# EasyEDA Pro project ProPrj_AIoT-NTU-Prototype_2026-03-28.epro, board Main Board
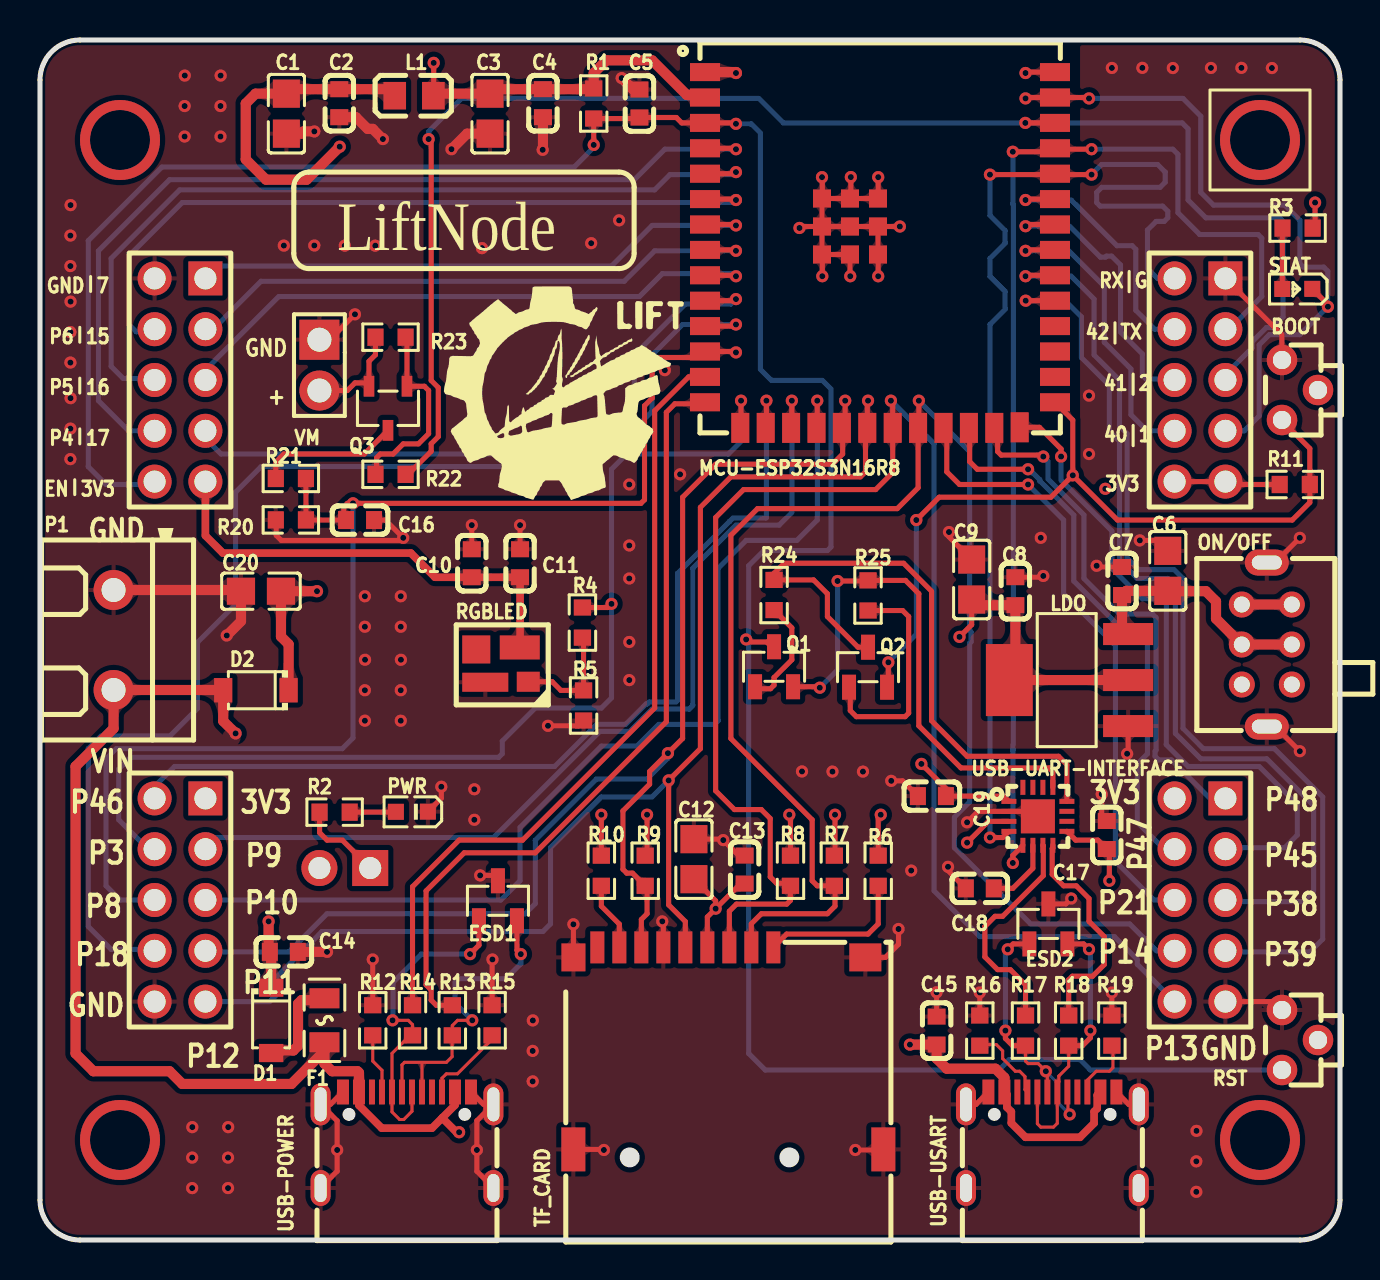
[diagram p3: board, top side]
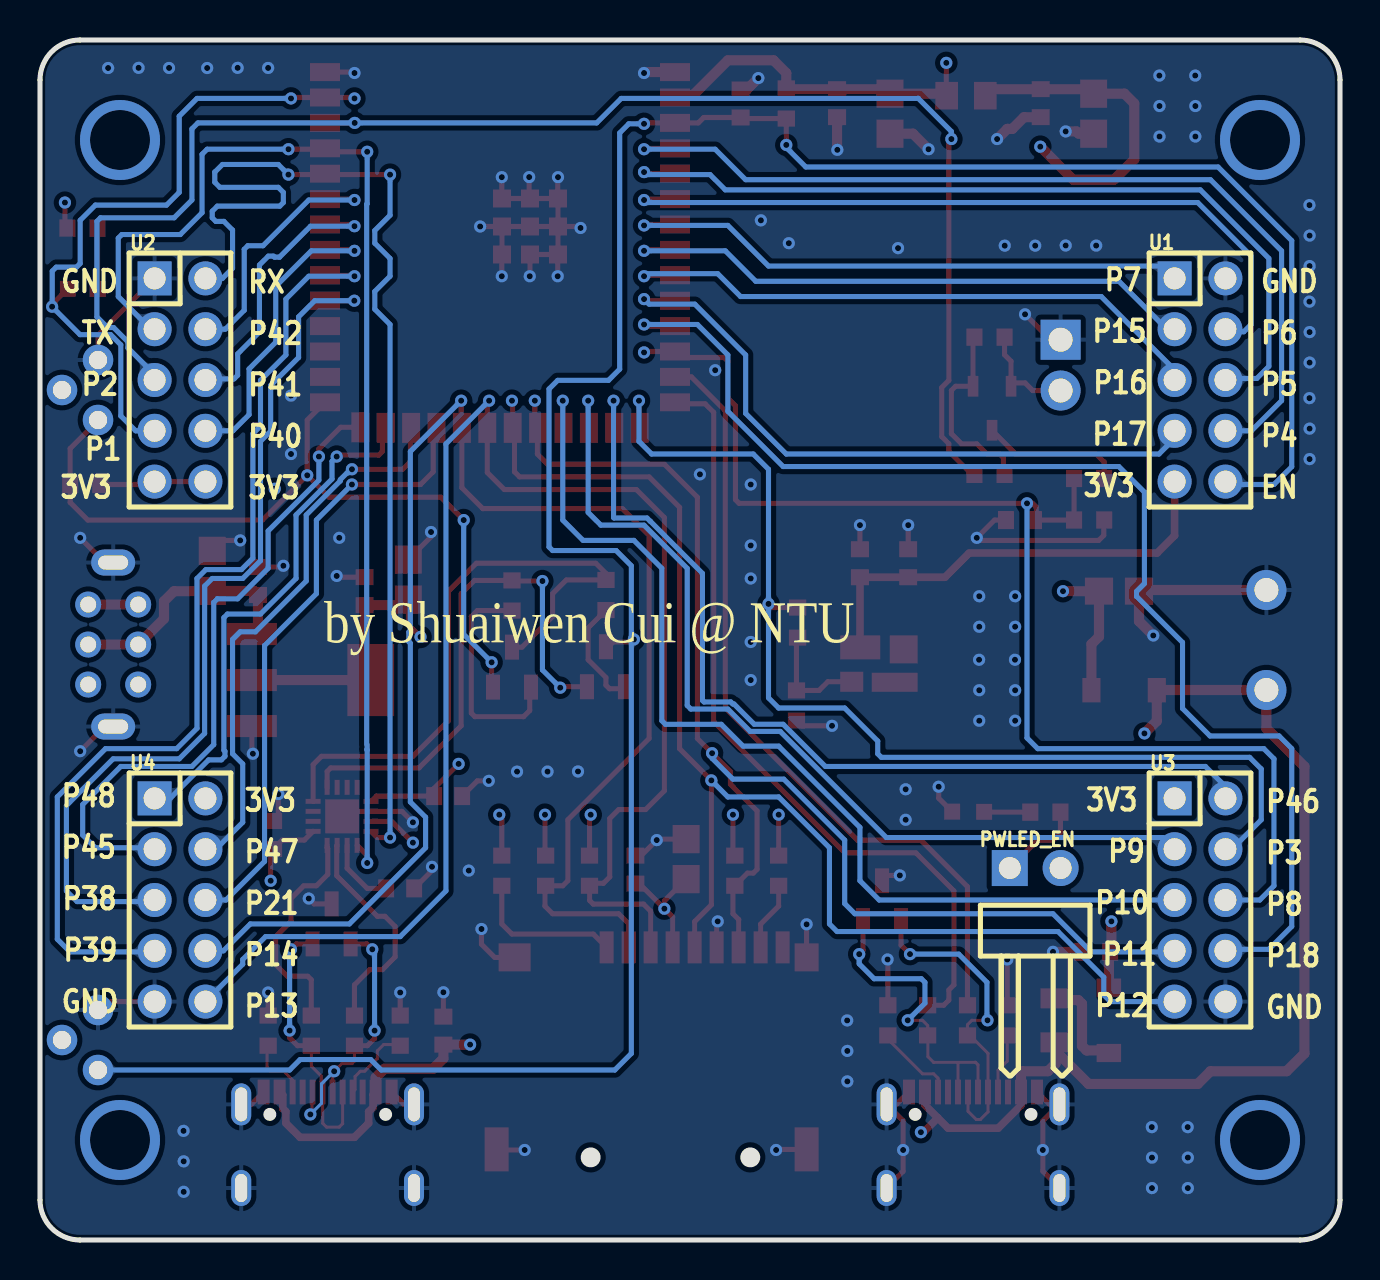
[diagram p4: board, bottom side, seen from below]

Outline 65 x 60 mm; copper layers: Top Layer, GND, PWR, Bottom Layer. Coordinates in mm from the lower left corner of the outline.
Outline path: 0,58 0,2 arc(0.59,0.59) 2,0 63,0 arc(64.41,0.59) 65,2 65,58 arc(64.41,59.41) 63,60 2,60 arc(0.59,59.41) 0,58
Stack: Top Layer 0.035mm Outer layer thickness 1oz / Dielectric1 0.2104mm 7628 RC49% 8.6mil / GND 0.0152mm Inner layer thickness / Dielectric2 1.065mm 1.1mm H/HOZ Copper / PWR 0.0152mm Inner layer thickness / Dielectric3 0.2104mm 7628 RC49% 8.6mil / Bottom Layer 0.035mm Outer layer thickness 1oz

## Design rules (mm)
net $2N532: DP1
net $2N529: DP1
net $2N923: DP3
net $2N927: DP3
net GPIO19: DP2
net GPIO20: DP2
net U0RXD: DP5
net U0TXD: DP5
net CH343P_D+: DP4
net CH343P_D-: DP4
template: JLCPCB Capability(Two Layers Board)
spacing copperThickness1oz (default): track to track 0.102, other pairs 0.152 to 0.3
spacing copperThickness2oz: track to track 0.203, other pairs 0.152 to 0.3
track width copperThickness1oz (default): min 0.127, default 0.254, max 2.54
track width copperThickness2oz: min 0.203, default 0.254, max 2.54
differential pair differentialPair (default): width min 0.127, default 0.254, max 2.54; gap min 0.152, default 0.152
via viaSize (default): diameter min 0.5, default 0.61, max 10; hole min 0.3, default 0.305, max 6.3

## Placement (name value [footprint] x y rotation side)
BOOT  TS4538B3J  [SW-TH_TS4538B3J]  63 42.5 90 top
C1  10uF/50V(10%)  [C0805]  12.32 56.32 90 top
C2  100nF/50V(10%)  [C0603]  14.96 56.84 90 top
C3  22uF/25V(20%)  [C0805]  22.5 56.32 90 top
C4  100nF/50V(10%)  [C0603]  25.15 56.84 90 top
C5  1uF/16V(10%)  [C0603]  29.97 56.83 90 top
C6  10uF/50V(10%)  [C0805]  56.39 33.46 270 top
C7  100nF/50V(10%)  [C0603]  54.1 32.95 270 top
C8  100nF/50V(10%)  [C0603]  48.77 32.44 270 top
C9  10uF/50V(10%)  [C0805]  46.58 33.02 270 top
C10  1uF/16V(10%)  [C0603]  21.59 33.84 90 top
C11  100nF/50V(10%)  [C0603]  24 33.84 270 top
C12  10uF/50V(10%)  [C0805]  32.7 19.04 270 top
C13  100nF/50V(10%)  [C0603]  35.23 18.52 270 top
C14  100nF/50V(10%)  [C0603]  12.19 14.41 180 top
C15  100nF/50V(10%)  [C0603]  44.83 10.47 270 top
C16  100nF/50V(10%)  [C0603]  16 36 0 top
C17  1uF/16V(10%)  [C0603]  53.34 20.25 90 top
C18  100nF/50V(10%)  [C0603]  46.99 17.58 0 top
C19  100nF/50V(10%)  [C0603]  44.59 22.19 180 top
C20  10uF/50V(10%)  [C0805]  11.05 32.44 180 top
D1  1N5819HW-7-F  [SOD-123_L2.7-W1.6-LS3.7-RD]  11.56 10.98 270 top
D2  1N5819HW-7-F  [SOD-123_L2.7-W1.6-LS3.7-RD]  10.79 27.49 180 top
ESD1  PESD5V0U2BT  [SOT-23-3_L2.9-W1.3-P1.90-LS2.4-BR]  22.9 16.96 270 top
ESD2  PESD5V0U2BT  [SOT-23-3_L2.9-W1.3-P1.90-LS2.4-BR]  50.42 15.8 270 top
F1  SMD0805-050-6  [F0805]  14.22 10.98 90 top
L1  BEAD  [L0805]  18.7 57.21 0 top
LDO  SGM2212-3.3XKC3G/TR  [SOT-223-3_L6.5-W3.4-P2.30-LS7.0-BR]  51.44 28 0 top
MCU-ESP32S3N16R8  ESP32-S3-WROOM-1U-N16R8  [WIRELM-SMD_ESP32-S3-WROOM-1U]  42 49.5 0 top
ON/OFF  KH-SK22D07-G5  [SW-TH_KH-SK22D07-G5]  61.34 29.77 90 top
P1  KF301-2P接线端子  [CONN-TH_XY301V-A-5.0-2P]  3.68 30 90 top
PWLED_EN  PZ254R-11-02P  [HDR-TH_2P-P2.54-H-M-W10.4]  15.24 18.6 180 bottom
PWR  XL-1608UGC-04  [LED0603-RD_GREEN]  18.59 21.41 180 top
Q1  S8050  [SOT-23-3_L2.9-W1.3-P1.90-LS2.4-BR]  36.7 28.66 270 top
Q2  S8050  [SOT-23-3_L2.9-W1.3-P1.90-LS2.4-BR]  41.4 28.64 270 top
Q3  SI2301CDS-T1-GE3  [SOT-23-3_L3.0-W1.7-P0.95-LS2.9-BR]  17.4 41.58 90 top
R1  10kΩ  [R0603]  27.69 56.83 270 top
R2  2.2kΩ  [R0603]  14.73 21.39 0 top
R3  2.2kΩ  [R0603]  62.88 50.6 180 top
R4  330Ω  [R0603]  27.12 30.87 90 top
R5  100kΩ  [R0603]  27.18 26.73 90 top
R6  10kΩ  [R0603]  41.91 18.46 90 top
R7  10kΩ  [R0603]  39.72 18.46 90 top
R8  10kΩ  [R0603]  37.52 18.46 90 top
R9  10kΩ  [R0603]  30.26 18.46 90 top
R10  10kΩ  [R0603]  28.07 18.46 90 top
R11  10kΩ  [R0603]  62.74 37.78 0 top
R12  5.1kΩ  [R0603]  16.64 10.98 90 top
R13  22Ω  [R0603]  20.62 10.98 90 top
R14  22Ω  [R0603]  18.63 10.98 90 top
R15  5.1kΩ  [R0603]  22.61 10.98 90 top
R16  5.1kΩ  [R0603]  46.99 10.47 90 top
R17  22Ω  [R0603]  49.28 10.47 90 top
R18  22Ω  [R0603]  51.44 10.47 90 top
R19  5.1kΩ  [R0603]  53.59 10.47 90 top
R20  100kΩ  [R0603]  12.54 36 0 top
R21  300kΩ  [R0603]  12.54 38.08 180 top
R22  220Ω  [R0603]  17.53 38.28 0 top
R23  1mΩ  [R0603]  17.53 45.14 180 top
R24  10kΩ  [R0603]  36.7 32.25 270 top
R25  10kΩ  [R0603]  41.4 32.23 270 top
RGBLED  SK6812MINI-C  [LED-SMD_4P-L3.5-W3.5-R-SK6812MINI]  23.11 28.76 0 top
RST  TS4538B3J  [SW-TH_TS4538B3J]  63 10 90 top
STAT  XL-1608UBC-04  [LED0603-RD_BLUE]  62.87 47.55 180 top
TF_CARD  TF-CARD-Gold H1.8  [TF-SMD_TF-CARD-H1.8]  34.42 9.58 0 top
U1  DS1021-2x5SF11-B  [HDR-TH_10P-P2.54-V-M-R2-C5-S2.54]  7 43 270 bottom
U2  DS1021-2x5SF11-B  [HDR-TH_10P-P2.54-V-M-R2-C5-S2.54]  58 43 270 bottom
U3  DS1021-2x5SF11-B  [HDR-TH_10P-P2.54-V-M-R2-C5-S2.54]  7 17 270 bottom
U4  DS1021-2x5SF11-B  [HDR-TH_10P-P2.54-V-M-R2-C5-S2.54]  58 17 270 bottom
USB-POWER  GT-USB-7010ASV  [USB-C-SMD_G-SWITCH_GT-USB-7010ASV]  18.35 5 0 top
USB-UART-INTERFACE  CH343P  [TQFN-16_L3.0-W3.0-P0.50-BL-EP1.7]  49.89 21.18 270 top
USB-USART  GT-USB-7010ASV  [USB-C-SMD_G-SWITCH_GT-USB-7010ASV]  50.62 5 0 top
VM  PZ254V-11-02P  [HDR-TH_2P-P2.54-V-M]  13.97 43.74 270 top

## Footprints (pads in the part's own frame, mm; a bottom-side part is the same pattern mirrored in y, then rotated)
C0603
  rect 0.8x0.9 smd: 1(-0.7,0) 2(0.7,0)
C0805
  rect 1.41x1.35 smd: 1(-1,0) 2(1,0)
CONN-TH_XY301V-A-5.0-2P
  round 2 hole 1.2: 1(-2.5,0) 2(2.5,0)
F0805
  rect 1x1.5 smd: 1(-1.1,0) 2(1.1,0)
HDR-TH_2P-P2.54-H-M-W10.4
  rect 1.8x1.8 hole 1.1: 1(-1.27,0)
  round 1.8 hole 1.1: 2(1.27,0)
HDR-TH_2P-P2.54-V-M
  rect 2x2 hole 1.2: 1(-1.27,0)
  round 2 hole 1.2: 2(1.27,0)
HDR-TH_10P-P2.54-V-M-R2-C5-S2.54
  rect 1.7x1.7 hole 1.1: 1(-5.08,-1.27)
  round 1.7 hole 1.1: 2(-5.08,1.27) 3(-2.54,-1.27) 4(-2.54,1.27) 5(0,-1.27) 6(0,1.27) 7(2.54,-1.27) 8(2.54,1.27) 9(5.08,-1.27) 10(5.08,1.27)
L0805
  rect 1.133x1.377 smd: 1(-0.966,0) 2(0.966,0)
LED0603-RD_BLUE
  rect 0.8x0.8 smd: 1(-0.749,-0.004) 2(0.749,0.004)
LED0603-RD_GREEN
  rect 0.8x0.8 smd: 1(-0.799,-0.004) 2(0.799,0.004)
LED-SMD_4P-L3.5-W3.5-R-SK6812MINI
  rect 1.15x1 smd: 1(1.3,-0.845)
  rect 2x1.2 smd: 2(0.875,0.87)
  rect 1.4x1.4 smd: 3(-1.3,0.77)
  rect 2.3x0.95 smd: 4(-0.85,-0.87)
R0603
  rect 0.806x0.864 smd: 1(-0.753,0) 2(0.753,0)
SOD-123_L2.7-W1.6-LS3.7-RD
  rect 0.91x1.22 smd: 1(-1.635,0) 2(1.635,0)
SOT-23-3_L2.9-W1.3-P1.90-LS2.4-BR
  rect 1.25x0.7 smd: 1(1,-0.95) 2(1,0.95) 3(-1,0)
SOT-23-3_L3.0-W1.7-P0.95-LS2.9-BR
  rect 1.038x0.532 smd: 1(1.101,-0.95) 2(1.101,0.95) 3(-1.101,0)
SOT-223-3_L6.5-W3.4-P2.30-LS7.0-BR
  rect 2.5x1.1 smd: 1(2.97,-2.3) 2(2.97,0) 3(2.97,2.3)
  rect 2.34x3.6 smd: 4(-2.97,0)
SW-TH_KH-SK22D07-G5
  round 1.3 hole 0.8: 1(-2,1.25) 2(0,1.25) 3(2,1.25) 4(-2,-1.25) 5(0,-1.25) 6(2,-1.25)
  oval 1.3x2.2 hole 0.7x1.5: 7(-4.1,0) 8(4.1,0)
SW-TH_TS4538B3J
  round 1.524 hole 0.914: 1(-1.5,0.9) 2(1.5,0.9) 3(0,-0.9)
TF-SMD_TF-CARD-H1.8
  rect 0.7x1.6 smd: 1(2.25,5.05) 2(1.15,5.05) 3(0.05,5.05) 4(-1.05,5.05) 5(-2.15,5.05) 6(-3.25,5.05) 7(-4.35,5.05) 8(-5.45,5.05) 9(-6.55,5.05)
  rect 1.2x1.4 smd: 10(-7.747,4.55)
  rect 1.2x2.2 smd: 11(-7.75,-5.05) 12(7.75,-5.05)
  rect 1.6x1.4 smd: 13(6.85,4.55)
TQFN-16_L3.0-W3.0-P0.50-BL-EP1.7
  rect 0.25x0.75 smd: 1(-0.749,-1.45) 2(-0.248,-1.45) 3(0.252,-1.45) 4(0.751,-1.45) 9(0.75,1.45) 10(0.25,1.45) 11(-0.25,1.45) 12(-0.749,1.45)
  rect 0.75x0.25 smd: 5(1.45,-0.75) 6(1.45,-0.25) 7(1.45,0.25) 8(1.45,0.75) 13(-1.45,0.75) 14(-1.45,0.25) 15(-1.45,-0.25) 16(-1.45,-0.75)
  rect 1.7x1.7 smd: 17(0.001,0)
USB-C-SMD_G-SWITCH_GT-USB-7010ASV
  oval 1x2.1 hole 0.6x1.7: 1(-4.32,1.78) 2(4.32,1.78)
  oval 1x1.8 hole 0.6x1.4: 3(4.32,-2.4) 4(-4.32,-2.4)
  rect 0.6x1.24 smd: A1B12(-3.2,2.4) A4B9(-2.4,2.4) B1A12(3.2,2.4) B4A9(2.4,2.4)
  rect 0.3x1.24 smd: A5(-1.25,2.4) A6(-0.25,2.4) A7(0.25,2.4) A8(1.25,2.4) B5(1.75,2.4) B6(0.75,2.4) B7(-0.75,2.4) B8(-1.75,2.4)
WIRELM-SMD_ESP32-S3-WROOM-1U
  rect 1.5x0.9 smd: 1(-8.75,8.895) 2(-8.75,7.625) 3(-8.75,6.355) 4(-8.75,5.085) 5(-8.75,3.815) 6(-8.75,2.545) 7(-8.75,1.275) 8(-8.75,0.005) 9(-8.75,-1.265) 10(-8.75,-2.535) 11(-8.75,-3.805) 12(-8.75,-5.075) 13(-8.75,-6.345) 14(-8.75,-7.615) 27(8.75,-7.615) 28(8.75,-6.345) 29(8.75,-5.075) 30(8.75,-3.805) 31(8.75,-2.535) 32(8.75,-1.265) 33(8.75,0.005) 34(8.75,1.275) 35(8.75,2.545) 36(8.75,3.815) 37(8.75,5.085) 38(8.75,6.355) 39(8.75,7.625) 40(8.75,8.895)
  rect 0.9x1.5 smd: 15(-6.985,-8.895) 16(-5.715,-8.895) 17(-4.445,-8.895) 18(-3.175,-8.895) 19(-1.905,-8.895) 20(-0.635,-8.895) 21(0.635,-8.895) 22(1.905,-8.895) 23(3.175,-8.895) 24(4.445,-8.895) 25(5.715,-8.895) 26(6.985,-8.865)
  rect 0.9x0.9 smd: 41(-2.9,2.575) 41(-2.9,1.175) 41(-2.9,-0.225) 41(-1.5,2.575) 41(-1.5,1.175) 41(-1.5,-0.225) 41(-0.1,2.575) 41(-0.1,1.175) 41(-0.1,-0.225)

## Nets
As in the schematic.

Pads without a net: BOOT 3; MCU-ESP32S3N16R8 28 29 30; ON/OFF 1 4; RGBLED 3; RST 3; TF_CARD 9; USB-POWER A8 B8; USB-UART-INTERFACE 10 11 14 15 16; USB-USART A8 B8

## Via types
v1: diameter 4, hole 3, Top Layer to Bottom Layer, 4 vias
v2: diameter 0.61, hole 0.305, Top Layer to Bottom Layer, 193 vias

## Routing (per net, layer and track width the routed paths; a pad name or vN(x,y) marks a point on that pad's centre or on a via; arc(x,y) is an arc through that point)
GND: length 125.4
  Top Layer w0.254: MCU-ESP32S3N16R8.41 MCU-ESP32S3N16R8.41 40.5,48.2 v2(40.51,48.19) ; MCU-ESP32S3N16R8.41 39.12,49.26 v2(39.12,48.19) ; MCU-ESP32S3N16R8.41 MCU-ESP32S3N16R8.41 ; 26.67,4.53 28.16,4.53 v2(28.19,4.5) ; R15.2 22.61,14.01 v2(22.62,14.03) ; R20.1 11.81,35.98 11.81,35.23 12.06,34.98 18.03,34.98 v2(18.16,35.11) 17.27,36 C16.2 ; MCU-ESP32S3N16R8.41 40.54,52.12 v2(40.54,53.15) ; MCU-ESP32S3N16R8.41 MCU-ESP32S3N16R8.41 41.91,52.08 v2(41.91,53.14) ; MCU-ESP32S3N16R8.41 MCU-ESP32S3N16R8.41 ; v2(62.99,24.44) 61.76,25.67 ON/OFF.7 ; v2(45.4,18.66) 45.4,18.47 C18.1 ; C11.1 v2(24,35.74) ; v2(25.4,25.71) 26.92,25.71 R5.1 ; PWR.1 20.07,22.09 v2(20.07,22.66) ; v2(31.12,15.93) 31.17,15.88 31.17,14.63 ; 62.09,43.97 62.09,45.26 U2.1 ; C8.1 50.1,33.14 v2(50.16,33.2) ; v2(46.35,20.88) 46.9,21.43 USB-UART-INTERFACE.2 49.65,21.43 USB-UART-INTERFACE.17 ; v2(54.99,34.98) 55.86,34.98 C6.1 ; MCU-ESP32S3N16R8.41 MCU-ESP32S3N16R8.41 41.91,49.27 v2(41.91,48.19) ; MCU-ESP32S3N16R8.41 v2(42.99,50.67) ; MCU-ESP32S3N16R8.41 MCU-ESP32S3N16R8.41 MCU-ESP32S3N16R8.41 ; v2(42.93,15.55) 42.93,14.79 42.27,14.13 41.27,14.13 ; 22.67,2.61 21.84,3.43 v2(21.84,4.5) 21.84,5.96 22.67,6.79 22.17,6.79 21.55,7.41 ; USB-USART.B1A12 54.44,6.78 USB-USART.2 ; R12.2 v2(16.64,14.03) ; RST.2 61.68,11.92 U4.9 ; MCU-ESP32S3N16R8.40 49.32,58.39 v2(49.28,58.35) ; v2(53.09,22.29) 53.09,21.2 C17.2 ; v2(40.77,4.5) 42.14,4.5 42.17,4.53 ; v2(54.36,24.31) 54.41,24.36 LDO.1 ; C10.2 v2(21.59,35.74) ; v2(45.45,35.4) 45.45,35.16 C9.1 ; MCU-ESP32S3N16R8.41 MCU-ESP32S3N16R8.41 ; MCU-ESP32S3N16R8.41 39.12,52.09 39.12,53.14 ; MCU-ESP32S3N16R8.41 38.05,50.67 v2(37.97,50.6) ; USB-USART.A1B12 46.8,6.78 USB-USART.1 ; v2(42.56,22.96) 43.13,22.96 C19.2 ; v2(52.83,33.71) 52.89,33.65 C7.1 ; C12.1 34.12,20.04 v2(34.16,20) 34.94,19.22 C13.1 ; ESD1.3 22.63,18.23 v2(22.01,18.23) ; v2(62.99,35.11) 61.76,33.87 ON/OFF.8 ; 26.67,14.13 v2(26.67,15.78) ; C15.1 44.83,12.39 ; v2(51.56,17.07) 51.29,16.8 ESD2.3 ; VM.1 14.48,45.01 v2(15.75,46.28) ; R16.2 v2(46.99,12.38) ; 14.03,2.61 14.86,3.44 v2(14.86,4.5) 14.86,5.96 14.03,6.79 14.53,6.79 15.15,7.41 ; R19.2 v2(53.59,12.38)
  Top Layer w0.508: v2(13.72,55.43) 13.18,55.43 13.06,55.32 C1.1 ; C4.1 25.15,54.52 v2(25.13,54.51) ; C2.1 15.8,56.14 16.38,55.56 16.64,55.56 v2(17.15,55.05) ; C5.2 29.65,57.53 v2(29.08,58.09) ; v2(34.8,58.35) 34.75,58.39 MCU-ESP32S3N16R8.1 ; P1.2 9.99,32.5 C20.2 10.05,30.94 v2(9.34,30.22) ; C3.1 21.35,55.32 v2(20.57,54.54) ; C14.1 v2(14.35,14.41)
  vias: v2(1.53,51.75) v2(1.52,50.22) v2(1.52,48.7) v2(1.53,46.92) v2(1.52,45.39) v2(1.52,43.87) v2(1.53,42.09) v2(1.52,40.57) v2(1.52,39.05) v2(7.24,58.22) v2(7.23,56.7) v2(7.23,55.17) v2(7.62,5.64) v2(7.61,4.12) v2(7.61,2.6) v2(9.03,58.22) v2(9.03,56.7) v2(9.03,55.17) v2(9.41,5.64) v2(9.4,4.12) v2(9.4,2.6) v2(12.19,49.72) v2(13.72,49.72) v2(15.24,49.72) v2(16.24,32.19) v2(16.24,30.66) v2(16.24,27.49) v2(16.24,25.96) v2(16.25,29.01) v2(16.76,49.72) v2(18.04,32.19) v2(18.04,30.66) v2(18.05,29.01) v2(18.04,27.49) v2(18.04,25.96) v2(21.72,22.53) v2(21.72,21.01) v2(22.1,49.59) v2(24.64,10.98) v2(24.63,9.45) v2(24.63,7.93) v2(27.56,49.84) v2(28.96,50.98) v2(29.46,37.78) v2(29.46,34.73) v2(29.46,33.08) v2(29.46,29.9) v2(29.46,28) v2(31.24,43.49) v2(32,38.28) v2(38.1,23.43) v2(39.1,53.14) v2(39.62,23.42) v2(41.15,23.42) v2(43.56,18.47) v2(44.83,12.39) v2(50.04,35.11) v2(52.45,42.22) v2(52.45,39.3) v2(53.59,58.6) v2(55.12,58.61) v2(56.64,58.6) v2(57.82,5.46) v2(57.82,3.93) v2(57.82,2.41) v2(58.55,58.6) v2(60.07,58.61) v2(61.59,58.6)
VCC_3V3: length 138.7
  Top Layer w0.254: R9.2 30.35,19.31 v2(30.35,21.27) ; v2(37.47,21.27) 37.52,21.21 R8.2 ; v2(42.04,21.27) 41.91,21.14 R6.2 ; R10.2 v2(28.07,21.27) ; R7.2 39.75,19.25 v2(39.75,21.27) ; C9.2 46.58,30.76 v2(45.97,30.16) ; C13.2 35.04,17.82 v2(33.78,16.57) ; C12.2 33.78,16.96 v2(33.78,16.57) ; v2(33.78,16.57) 33.37,16.15 33.37,14.63
  Top Layer w0.508: L1.1 17.41,57.54 C2.2 12.54,57.54 C1.2 10.78,57.32 10.29,56.83 10.29,54.03 11.3,53.02 13.34,53.02 v2(14.99,54.67) ; LDO.2 LDO.4 48.77,28.3 C8.2 46.86,31.74 C9.2
  PWR w0.508: v2(45.97,30.16) 45.97,21.9 45.34,21.27 v2(42.04,21.27) v2(39.75,21.27) v2(37.47,21.27) 35.79,21.27 ; v2(33.78,16.57) 35.79,18.58 35.79,21.27 ; 35.79,21.27 v2(30.35,21.27) v2(28.07,21.27) ; v2(28.07,21.27) 28.32,21.52 28.32,22.03 27.69,22.66 23.5,22.66 19.81,26.34 19.81,50.98 16.13,54.67 v2(14.99,54.67) ; v2(28.07,21.27) 26.42,19.61 21.21,19.61 18.29,16.69 14.6,16.69 13.97,17.33 PWLED_EN.2
VCC_5V: length 124.1
  Top Layer w0.508: v2(13.85,32.44) C20.1 12.05,30.17 12.43,29.79 D2.1 ; ON/OFF.3 ON/OFF.6 ; C14.2 11.56,14.34 D1.1 ; v2(11.43,15.93) 11.43,14.47
  PWR w0.508: v2(13.85,32.44) 13.85,25.59 11.43,23.17 v2(11.43,15.93) 11.43,2.22 12.7,0.94 55.88,0.94 56.39,1.45 56.39,5.39 60.71,9.71 60.71,12.38 64.01,15.68 64.01,31.04 63.28,31.77 ON/OFF.6
VINPUT: length 140.2
  Top Layer w0.254: v2(46.35,19.87) 47.42,20.93 48.43,20.93 ; v2(53.47,17.96) 53.47,19.42 C17.1 52.89,20 51.78,20 USB-UART-INTERFACE.9
  Top Layer w0.381: USB-USART.A4B9 48.35,7.27 48.35,6.63 48.57,6.41 48.57,5.84 49.28,5.14 52,5.14 52.71,5.84 52.71,6.42 52.86,6.58 52.86,7.24 USB-USART.B4A9 ; 20.11,6.1 19.6,5.59 17.09,5.59 15.95,6.73 15.95,7.41 ; 20.11,6.1 20.75,6.74 20.75,7.41 ; 20.11,6.1 20.82,5.39 v2(20.96,5.39)
  Top Layer w0.508: v2(9.78,25.33) 9.16,25.95 D2.2 9.15,27.5 P1.1 3.68,25.58 1.78,23.68 1.78,9.33 2.67,8.44 6.48,8.44 7.11,7.8 12.57,7.8 14.22,9.45 ; USB-USART.A4B9 48.22,8.12 47.77,8.56 45.34,8.56 44.83,9.07 C15.2 v2(43.5,9.77) ; F1.1 14.22,9.45 ; 14.22,9.45 14.22,8.82 14.6,8.44 15.88,8.44 15.95,8.36 15.95,7.41
  PWR w0.508: v2(9.78,25.33) 10.54,25.33 11.05,25.84 11.05,37.01 12.19,38.16 12.19,38.41 ; v2(46.35,19.87) 46.35,18.98 47.37,17.96 v2(53.47,17.96) 53.47,16.19 52.58,15.3 45.34,15.3 43.5,13.45 v2(43.5,9.77) 43.5,9.64 43.43,9.58 43.43,5.9 42.8,5.26 21.08,5.26 v2(20.96,5.39)
(no net):
  vias: v1(4,55) v1(4,5) v1(61,55) v1(61,5)
CH343P_D+: length 11.2
  Top Layer w0.254: R17.2 49.28,12.76 48.51,13.52 47.88,13.52 47.24,14.15 47.24,15.68 47.75,16.19 48.13,16.19 50.16,18.22 50.16,19.71 USB-UART-INTERFACE.7
CH343P_D-: length 11.3
  Top Layer w0.254: R18.2 51.44,13.01 51.61,13.19 52.63,13.19 53.21,13.77 53.21,15.17 52.45,15.93 52.45,17.07 51.82,17.71 51.18,17.71 50.61,18.28 50.61,19.57 50.64,19.61 USB-UART-INTERFACE.8
CHIP_PU: length 134.1
  Top Layer w0.254: v2(34.8,55.81) 34.75,55.86 MCU-ESP32S3N16R8.3 32.09,55.86 31.81,56.12 C5.1 29.92,56.07 R1.2 v2(27.69,54.75) ; v2(35.31,30.03) 35.43,29.9 36.34,29.9 36.58,29.66 Q1.3
  Bottom Layer w0.254: v2(34.8,55.81) 35.56,55.81 36.02,55.35 36.02,43.54 36.58,42.98 39.12,42.98 39.55,42.55 39.55,34.65 39.37,34.47 36.19,34.47 35.43,33.71 35.43,30.16 v2(35.31,30.03) 35.43,29.9 35.43,9.33 36.26,8.5 47.94,8.5 48.46,9.02 51.99,9.02 52.52,8.5 RST.1 ; v2(27.69,54.75) 27.69,54.63 26.71,53.65 6.1,53.65 2.41,49.97 2.41,38.66 3.3,37.78 5.71,37.78 5.73,37.79 U1.10
DTR: length 31.7
  Top Layer w0.254: USB-UART-INTERFACE.12 51.34,23.77 50.93,24.19 46.35,24.19 44.58,25.96 44.58,32.44 43.18,33.84 37.21,33.84 36.7,33.33 R24.1 38.68,33 39.37,32.31 39.37,31.17 40.9,29.64 Q2.3
ESP_3V3: length 226.1
  Top Layer w0.254: 19.69,57.23 v2(19.69,58.86) ; v2(63.75,51.87) 63.75,50.72 R3.1 ; v2(44.07,23.81) 45.29,22.58 C19.1 48.18,22.19 USB-UART-INTERFACE.1 ; R11.1 59.41,37.78 U2.9 U2.10
  Top Layer w0.381: RGBLED.2 24,29.64 C11.2 C10.1 19.75,33.14 18.54,34.35 9.14,34.35 8.27,35.22 U1.9
  Top Layer w0.508: MCU-ESP32S3N16R8.2 33.12,57.25 32.34,57.25 30.61,58.98 28.32,58.98 27.69,58.35 R1.1 27.65,57.54 C4.2 22.72,57.54 C3.2 19.77,57.32 L1.2
  PWR w0.508: v2(63.75,51.87) 62.99,51.11 54.36,51.11 53.26,50.02 v2(53.26,37.56) ; U4.2 U2.10 56.37,37.56 v2(53.26,37.56) ; v2(53.26,37.56) 53.25,37.56 52.43,36.73 51.16,36.73 50.9,36.48 44.34,36.48 44.11,36.71 43.52,36.71 43.29,36.48 27.08,36.48 26.57,36.99 25.27,36.99 ; 25.27,36.99 25.27,47.3 24.13,48.44 24.13,55.81 22.48,57.46 21.08,57.46 v2(19.69,58.86) 11.18,58.86 10.29,57.97 10.29,39.55 8.65,37.92 U1.9 U3.1 ; 25.27,36.99 25.27,31.3 26.03,30.54 26.03,26.09 26.92,25.2 42.93,25.2 44.07,24.06 v2(44.07,23.81)
GPIO0: length 39.6
  Top Layer w0.254: v2(51.64,38.23) 53.88,36 62.61,36 63.49,36.88 R11.2 63.49,39.57 62.09,40.97 ; v2(51.64,38.23) 50.55,37.14 44.96,37.14 v2(43.81,36) ; v2(51.64,38.23) 51.64,41 MCU-ESP32S3N16R8.27 ; v2(42.42,28.89) 42.42,27.71 Q2.2
  Bottom Layer w0.254: v2(43.81,36) 43.81,30.28 v2(42.42,28.89)
GPIO1: length 35
  Top Layer w0.254: v2(49.28,57.08) 49.32,57.12 MCU-ESP32S3N16R8.39 52.41,57.12 v2(52.45,57.08) ; STAT.1 64.4,46.78 v2(64.4,46.67)
  Bottom Layer w0.254: U2.7 60.22,40.46 60.96,41.2 60.96,44.76 61.47,45.27 63,45.27 v2(64.4,46.67) 64.39,46.67 64.39,48.44 64.19,48.64 63.17,48.64 62.99,48.82 62.99,50.98 62.23,51.75 58.67,51.75 58.04,52.38 58.04,56.19 57.15,57.08 v2(52.45,57.08)
GPIO2: length 76.9
  Top Layer w0.254: MCU-ESP32S3N16R8.38 v2(49.27,55.86) ; v2(19.43,55.05) 19.56,54.92 19.56,42.98 19.91,42.62 19.91,40.17 19.56,39.81 19.56,39.43 18.41,38.28 R22.2
  Bottom Layer w0.254: U2.5 59.27,43.27 60.6,44.61 60.6,44.91 61.32,45.62 61.62,45.62 62.16,46.16 62.16,50.93 61.98,51.11 58.29,51.11 57.4,52 57.4,55.56 57.1,55.86 v2(49.27,55.86) 37.16,55.86 35.94,57.08 21.08,57.08 19.43,55.43 v2(19.43,55.05)
GPIO3: length 54.8
  Top Layer w0.254: v2(35.05,41.97) 35.05,40.64 MCU-ESP32S3N16R8.15 ; v2(28.57,31.81) 28.39,31.62 R4.2
  Bottom Layer w0.254: U3.4 5.41,19.54 3.94,21.01 3.94,23.55 4.52,24.13 22.93,24.13 23.11,24.31 23.11,24.95 24.76,26.6 28.07,26.6 28.57,27.11 v2(28.57,31.81) 28.57,38.54 29.34,39.3 34.42,39.3 35.05,39.93 v2(35.05,41.97)
GPIO4: length 46.5
  Top Layer w0.254: v2(34.8,54.54) 34.75,54.58 MCU-ESP32S3N16R8.4
  Bottom Layer w0.254: v2(34.8,54.54) 31.24,54.54 29.72,53.02 6.48,53.02 2.92,49.46 2.92,41.97 4.43,40.46 U1.8
GPIO5: length 42.5
  Top Layer w0.254: MCU-ESP32S3N16R8.5 34.72,53.31 v2(34.8,53.4)
  Bottom Layer w0.254: v2(34.8,53.4) 34.67,53.27 31.5,53.27 30.73,52.51 6.98,52.51 3.56,49.08 3.56,43.68 4.16,43.08 5.53,43.08 5.6,43 U1.6
GPIO6: length 38
  Top Layer w0.254: MCU-ESP32S3N16R8.6 34.75,52.05 v2(34.8,52)
  Bottom Layer w0.254: v2(34.8,52) 34.67,51.87 7.11,51.87 4.44,49.2 4.44,45.78 4.81,45.41 5.6,45.41 U1.4
GPIO7: length 29.2
  Top Layer w0.254: MCU-ESP32S3N16R8.7 34.75,50.78 v2(34.8,50.73)
  Bottom Layer w0.254: U1.1 8.89,48.7 28.57,48.7 30.61,50.73 v2(34.8,50.73)
GPIO8: length 65.1
  Top Layer w0.254: R21.1 R20.2 13.3,36 C16.1 15.19,36.11 15.19,36.65 15.37,36.83 30.05,36.83 30.23,37.01 30.23,41.71 30.61,42.09 30.61,43.95 30.79,44.12 32.95,44.12 MCU-ESP32S3N16R8.12 34.75,44.42 v2(34.8,44.38)
  Bottom Layer w0.254: U3.6 4.01,17 3.3,17.71 3.3,24.06 3.81,24.57 15.11,24.57 15.65,25.1 v2(15.65,36.83)
GPIO9: length 47.3
  Top Layer w0.254: MCU-ESP32S3N16R8.17 37.59,40.64 v2(37.59,41.97)
  Bottom Layer w0.254: v2(37.59,41.97) 37.59,36.38 36.96,35.74 34.8,35.74 32.64,33.58 32.64,26.73 32.46,26.55 30.61,26.55 29.49,25.43 27.99,25.43 22.68,20.12 8.85,20.12 U3.3
GPIO10: length 51.8
  Top Layer w0.254: v2(38.86,41.97) 38.86,40.64 MCU-ESP32S3N16R8.18
  Bottom Layer w0.254: U3.5 23.04,17 24,17.96 24,20.63 28.07,24.69 29.84,24.69 30.94,25.78 33.73,25.78 33.91,25.96 33.91,33.58 35.31,34.98 37.85,34.98 38.86,36 v2(38.86,41.97)
GPIO11: length 65.5
  Top Layer w0.254: v2(40.26,41.97) 40.26,40.77 MCU-ESP32S3N16R8.19 40.13,40.57 40.13,39.3 39.62,38.79 33.78,38.79 32.13,37.14 32.13,25.08 v2(31.4,24.34) 30.48,23.42 30.48,22.79 29.15,21.46 29.15,18.53 29.34,18.34 29.63,18.34 R9.1 30.35,17.62 30.35,16.31 30.07,16.03 30.07,14.63
  Bottom Layer w0.254: v2(31.4,24.34) 31.4,24.09 30.35,23.04 27.81,23.04 24.76,20 24.76,16.82 24.26,16.31 14.35,16.31 12.45,14.41 8.32,14.41 U3.7
GPIO12: length 66.1
  Top Layer w0.254: 32.27,14.63 32.27,15.92 31.43,16.76 v2(31.43,22.98) 33.02,24.57 33.02,36.63 34.54,38.16 41.02,38.16 41.28,38.41 41.28,40.52 MCU-ESP32S3N16R8.20 41.37,41.93 v2(41.4,41.97)
  Bottom Layer w0.254: v2(31.43,22.98) 30.61,22.15 28.07,22.15 25.53,19.61 25.53,15.8 25.15,15.42 14.1,15.42 11.81,13.14 11.81,12.25 11.48,11.92 U3.9
GPIO13: length 80.2
  Top Layer w0.254: 34.47,14.63 34.47,16.44 34.82,16.8 37.34,16.8 37.52,16.97 37.52,17.7 R8.1 37.4,17.84 36.83,17.84 36.51,18.15 36.51,21.07 36.07,21.52 34.72,21.52 33.78,22.46 33.78,36.12 35.18,37.52 41.78,37.52 42.63,38.37 MCU-ESP32S3N16R8.21 42.63,41.88 v2(42.54,41.97)
  Bottom Layer w0.254: v2(42.54,41.97) 44.7,39.81 44.7,17.45 46.99,15.17 53.72,15.17 54.86,14.03 54.86,13.79 U4.10
GPIO14: length 78.6
  Top Layer w0.254: v2(43.94,41.97) 43.94,40.64 MCU-ESP32S3N16R8.22 43.91,37.61 42.86,36.57 35.88,36.57 34.54,35.23 34.54,25.08 38.61,21.01 38.61,17.96 38.86,17.71 39.72,17.71 R7.1 39.75,17.68 39.75,16.69 39.37,16.31 36.07,16.31 35.57,15.81 35.57,14.63
  Bottom Layer w0.254: U4.8 55.83,14.46 54.48,15.8 49.53,15.8 45.72,19.61 45.72,21.14 46.48,21.9 46.48,29.84 46.56,29.91 46.56,30.4 46.48,30.47 46.48,39.43 v2(43.94,41.97)
GPIO15: length 29.7
  Top Layer w0.254: MCU-ESP32S3N16R8.8 34.75,49.5 v2(34.8,49.46)
  Bottom Layer w0.254: U1.3 8.65,45.54 11.05,47.94 29.21,47.94 30.73,49.46 v2(34.8,49.46)
GPIO16: length 30.6
  Top Layer w0.254: v2(34.8,48.19) 34.75,48.23 MCU-ESP32S3N16R8.9
  Bottom Layer w0.254: v2(34.8,48.19) 34.67,48.32 31.12,48.32 29.97,47.17 11.94,47.17 8.27,43.5 U1.5
GPIO17: length 33.7
  Top Layer w0.254: MCU-ESP32S3N16R8.10 34.72,46.97 v2(34.8,47.05)
  Bottom Layer w0.254: v2(34.8,47.05) 34.54,46.79 32.26,46.79 29.72,44.25 29.72,41.33 27.69,39.3 9.05,39.3 8.27,40.08 U1.7
GPIO18: length 62.7
  Top Layer w0.254: v2(34.8,45.78) 34.72,45.69 MCU-ESP32S3N16R8.11
  Bottom Layer w0.254: U3.8 5.66,14.53 3.56,14.53 2.41,15.68 2.41,24.57 3.05,25.2 6.5,25.2 7.87,26.58 7.87,29.88 10.17,32.18 10.17,32.43 9.78,32.82 9.78,37.39 11.06,38.67 27.84,38.67 30.61,41.44 30.61,44.25 32.13,45.78 v2(34.8,45.78)
GPIO19: length 39.8
  Top Layer w0.254: R14.2 18.63,17.67 20.96,20 24.13,20 30.73,26.6 30.73,41.46 32.43,43.16 MCU-ESP32S3N16R8.13
GPIO20: length 39.9
  Top Layer w0.254: R13.2 19.81,11.74 19.56,11.99 19.56,12.5 19.3,12.76 19.3,17.45 21.21,19.36 24.76,19.36 31.32,25.91 31.32,41.38 31.74,41.81 33.18,41.81 MCU-ESP32S3N16R8.14
GPIO21: length 31
  Top Layer w0.254: MCU-ESP32S3N16R8.23 45.34,40.44 45.34,38.41 45.97,37.78 v2(49.4,37.78)
  Bottom Layer w0.254: U4.6 55.7,17 53.77,18.93 53.77,29.72 51.18,32.31 51.18,36 v2(49.4,37.78)
GPIO38: length 45.6
  Top Layer w0.254: MCU-ESP32S3N16R8.31 v2(49.28,46.97)
  Bottom Layer w0.254: U4.5 59.35,16.92 63.15,16.92 63.68,17.45 63.68,21.72 61.34,24.06 58.04,24.06 56.77,25.33 56.77,32.69 56.39,33.08 54.86,33.08 53.97,33.97 53.97,39.93 53.47,40.44 53.47,42.73 52.07,44.12 52.07,46.16 51.26,46.97 v2(49.28,46.97)
GPIO39: length 50.4
  Top Layer w0.254: MCU-ESP32S3N16R8.32 49.32,48.23 v2(49.28,48.19)
  Bottom Layer w0.254: U4.7 59.32,14.41 63.5,14.41 64.13,15.04 64.13,22.15 61.72,24.57 58.17,24.57 57.15,25.58 57.15,33.08 56.71,33.52 54.93,33.52 54.36,34.09 54.36,40.31 53.97,40.7 53.97,42.98 52.71,44.25 52.71,47.05 51.56,48.19 v2(49.28,48.19)
GPIO40: length 15.7
  Top Layer w0.254: MCU-ESP32S3N16R8.33 49.32,49.5 v2(49.28,49.46)
  Bottom Layer w0.254: U2.8 55.35,40.46 54.55,41.27 54.55,43.55 53.21,44.89 53.21,47.68 51.44,49.46 v2(49.28,49.46)
GPIO41: length 14.8
  Top Layer w0.254: v2(49.28,50.69) 49.36,50.78 MCU-ESP32S3N16R8.34
  Bottom Layer w0.254: v2(49.28,50.69) 51.47,50.69 53.02,49.14 53.28,49.14 53.33,49.19 53.58,49.19 54.03,48.75 54.03,45.39 55.12,44.3 55.12,43.24 55.3,43.06 56.67,43.06 U2.6
GPIO42: length 13.4
  Top Layer w0.254: v2(49.28,52) 49.32,52.05 MCU-ESP32S3N16R8.35
  Bottom Layer w0.254: v2(49.28,52) 51.56,52 53.85,49.71 54.61,49.71 54.79,49.53 54.79,46.49 55.74,45.54 U2.4
GPIO45: length 33.3
  Top Layer w0.254: v2(51.05,39.17) 51.05,39.55 49.97,40.64 MCU-ESP32S3N16R8.26
  Bottom Layer w0.254: U4.3 59.34,19.61 62.23,19.61 62.87,20.25 62.87,21.77 60.96,23.68 57.4,23.68 56.31,24.77 56.31,31.88 56.13,32.06 55.12,32.06 53.59,33.58 53.59,35.45 51.06,37.99 51.06,39.17
GPIO46: length 47.7
  Top Layer w0.254: MCU-ESP32S3N16R8.16 36.32,40.64 v2(36.32,41.97)
  Bottom Layer w0.254: U3.2 5.73,22.68 6.73,23.68 25.73,23.68 27.84,25.79 29.29,25.79 30.3,26.8 30.36,26.8 30.46,26.9 31.8,26.9 31.88,26.98 31.88,33.33 34.49,35.94 34.5,35.94 34.65,36.1 36.3,36.1 36.32,36.12 v2(36.32,41.97)
GPIO47: length 28
  Top Layer w0.254: MCU-ESP32S3N16R8.24 46.48,40.57 46.48,38.92 46.86,38.54 v2(49.4,38.54)
  Bottom Layer w0.254: v2(49.4,38.54) 49.58,38.36 49.65,38.36 49.99,38.02 49.99,37.95 51.69,36.25 51.69,32.95 54.23,30.41 54.99,30.41 55.37,30.03 55.37,24.31 54.86,23.81 54.86,20.88 56.21,19.54 U4.4
GPIO48: length 26.3
  Top Layer w0.254: v2(50.16,39.17) 50.09,39.25 48.06,39.25 47.88,39.43 47.88,40.44 MCU-ESP32S3N16R8.25
  Bottom Layer w0.254: U4.1 58.49,22.08 56.57,24.01 55.93,24.01 55.75,24.19 55.75,24.44 55.81,24.49 55.81,31.12 55.63,31.3 53.97,31.3 52.2,33.08 52.2,36.25 50.4,38.05 50.4,38.94 v2(50.16,39.17)
LDO_VIN: length 12.3
  Top Layer w0.508: LDO.3 54.1,30.6 C7.2 54.31,32.46 C6.2 56.4,32.44 58.29,32.44 58.8,31.93 58.8,31.06 ON/OFF.2 ON/OFF.5
RTS: length 26.5
  Top Layer w0.254: 50.64,22.63 50.64,23.42 50.46,23.6 46.05,23.6 43.94,25.71 43.94,32.31 43.28,32.98 R25.1 41.37,32.95 v2(39.88,32.95) ; Q1.2 38.94,27.66 v2(38.99,27.61)
  Bottom Layer w0.254: v2(38.99,27.61) 39.88,28.5 v2(39.88,32.95)
U0RXD: length 58.1
  Top Layer w0.254: v2(47.5,53.27) 50.7,53.27 MCU-ESP32S3N16R8.36 50.8,53.27 v2(52.58,53.27) ; v2(47.5,20.12) 48.13,20.12 USB-UART-INTERFACE.4
  Bottom Layer w0.254: U2.2 55.88,48.08 55.37,48.59 55.37,50.5 55.81,50.93 56.21,50.93 56.39,51.11 56.39,51.44 56.13,51.69 53.01,51.69 52.83,51.87 52.83,52.38 53.09,52.63 56.01,52.63 56.26,52.89 56.26,53.4 56.26,53.4 55.88,53.78 53.09,53.78 v2(52.58,53.27) ; v2(47.5,53.27) 47.5,51.24 48.26,50.47 48.26,49.84 47.5,49.08 47.5,48.19 48.26,47.43 48.26,46.54 47.5,45.78 v2(47.5,20.12)
U0TXD: length 58.2
  Top Layer w0.254: v2(52.58,54.54) 50.8,54.54 MCU-ESP32S3N16R8.37 50.58,54.41 v2(48.64,54.41) ; USB-UART-INTERFACE.5 48.64,19.23 v2(48.64,18.85)
  Bottom Layer w0.254: v2(52.58,54.54) 56.64,54.54 56.9,54.28 56.9,51.36 57.99,50.27 60.91,50.27 61.09,50.09 61.09,47.17 59.45,45.54 U2.3 ; 48.64,24.5 48.64,24.75 ; 48.64,24.5 48.67,24.53 ; 48.64,24.5 v2(48.64,18.85) ; v2(48.64,54.41) 48.64,51.81 48.67,51.79 48.67,24.78
$1N1197: length 4.3
  Top Layer w0.254: R2.1 13.98,20.37 14.35,20 15.11,20 PWLED_EN.1
$1N1198: length 2.3
  Top Layer w0.254: R2.2 17.78,21.39 PWR.2
$1N1201: length 3
  Top Layer w0.254: R3.2 62.12,50.59 STAT.2
$1N1448: length 5.6
  Top Layer w0.254: RGBLED.1 25.61,27.91 26.04,27.48 R5.2 27.18,30.06 R4.1
$1N1818: length 7.6
  Top Layer w0.254: R6.1 41.91,15.8 41.4,15.3 37.33,15.3 36.67,14.63
$1N1819: length 3.5
  Top Layer w0.254: 28.97,14.63 28.97,15.79 28.07,16.69 R10.1
$2N527: length 3
  Top Layer w0.152: 16.64,10.23 16.64,8.95 17.1,8.48 USB-POWER.A5
$2N528: length 4.2
  Top Layer w0.152: 20.1,7.41 20.1,8.09 20.32,8.31 20.87,8.31 22.48,9.92 22.48,10.1 22.61,10.23
$2N529: length 16.3
  Top Layer w0.152: 18.1,7.41 18.1,8.76 18.23,8.88 20.32,8.88 20.6,9.17 20.6,10.22 20.62,10.23 20.62,10.72 20.88,10.98 v2(21.61,10.98) ; 19.1,7.41 19.1,8.88
  Top Layer w0.254: v2(24.04,14.29) 23.85,14.49 ESD1.2
  Bottom Layer w0.254: v2(24.04,14.29) 24.04,13.81 23.29,13.06 20.93,13.06 20.75,12.88 20.75,11.84 v2(21.61,10.98)
$2N532: length 16.4
  Top Layer w0.152: 18.6,7.41 18.6,6.44 18.19,6.03 17.98,6.03 17.6,6.41 17.6,9.33 18.5,10.23 18.63,10.23 18.63,10.77 18.41,10.98 v2(17.63,10.98)
  Top Layer w0.254: ESD1.1 21.95,14.74 v2(21.5,14.29)
  Bottom Layer w0.254: v2(21.5,14.29) 19.06,14.29 17.65,12.88 17.65,11.01 v2(17.63,10.98)
$2N538: length 5
  Top Layer w0.508: F1.2 14.1,12.08 14.01,11.99 13.08,11.99 12.9,11.81 12.9,9.71 12.67,9.48 11.68,9.48 11.56,9.35
$2N916: length 4
  Top Layer w0.152: R16.1 47.04,9.77 47.82,9.77 48.13,9.45 48.13,9.07 48.77,8.44 48.98,8.44 49.25,8.17 49.25,7.52 USB-USART.A5
$2N917: length 3.2
  Top Layer w0.152: USB-USART.B5 52.37,7.99 52.81,8.44 53.47,8.44 53.65,8.62 53.65,9.66 R19.1
$2N923: length 13.8
  Top Layer w0.152: USB-USART.B6 51.37,6.96 51.4,6.94 51.4,6.47 51.37,6.45 51.37,6.39 v2(51.48,6.28) ; USB-USART.A6 50.37,8.36 v2(50.29,8.44) 49.91,8.82 49.4,8.82 49.28,8.95 R17.1
  Top Layer w0.254: 49.47,14.8 48.66,14.8 v2(48.39,14.53) ; v2(48.27,10.47) 48.27,10.08 48.63,9.72 R17.1
  Bottom Layer w0.152: v2(51.48,6.28) 50.93,6.84 50.93,7.8 v2(50.29,8.44)
  Bottom Layer w0.254: v2(48.27,10.47) 48.27,14.42 v2(48.39,14.53)
$2N927: length 13.7
  Top Layer w0.152: USB-USART.B7 49.87,5.81 50.04,5.64 50.67,5.64 50.86,5.84 50.86,7.4 USB-USART.A7 50.87,7.84 50.94,7.91 50.94,8.2 51.44,8.69 R18.1
  Top Layer w0.254: v2(52.45,14.53) 52.18,14.8 ESD2.2 ; v2(52.52,10.47) 52.52,10.11 52.12,9.72 R18.1
  Bottom Layer w0.254: v2(52.52,10.47) 52.52,14.47 v2(52.45,14.53)
$2N1387: length 3.5
  Top Layer w0.254: USB-UART-INTERFACE.6 49.64,18.58 48.64,17.58 C18.2
$2N1709: length 5.6
  Top Layer w0.254: Q1.1 35.85,27.56 36.52,27.56 36.7,27.74 36.7,28.12 37.59,29.01 37.59,30.61 R24.2
$2N1712: length 11.3
  Top Layer w0.254: Q2.1 40.51,27.58 40.51,26.47 40.82,26.17 43.25,26.17 43.43,26.34 43.43,31.17 43.13,31.47 R25.2
$2N7675: length 5.3
  Top Layer w0.254: R23.2 16.77,44.26 16.45,43.94 Q3.2 16.28,42.86 15.75,42.86 15.37,42.47 VM.2
$2N7739: length 9.8
  Top Layer w0.254: R23.1 18.35,45.07 Q3.1 19.22,42.69 19.43,42.47 19.43,40.31 18.92,39.81 18.16,39.81 17.65,39.3 17.02,39.3 16.83,39.11 16.83,38.34 R22.1
$2N7794: length 7.1
  Top Layer w0.254: Q3.3 16.21,39.3 12.19,39.3 11.79,38.9 R21.2

## Copper pours and planes (outline as drawn; the poured copper is in the pictures)
GND on Top Layer: -1.65,62.16 69.09,62.16 69.09,-2.87 -1.65,-2.87
GND on Bottom Layer: -2.67,62.16 66.8,62.16 66.8,-2.48 -2.67,-2.48
GND on GND: -1.14,60.64 65.79,60.64 65.79,-0.71 -1.14,-0.71
VCC_3V3 on PWR: 13.46,54.92 14.35,55.81 14.35,55.94 18.67,55.94 18.8,56.06 18.8,55.94 21.6,53.14 21.6,26.99 21.46,26.85 25.02,23.3 41.6,23.3 41.91,22.98 42.61,22.98 43.43,22.15 44.83,22.15 45.34,22.66 45.34,30.41 46.23,31.3 52.07,31.3 53.34,30.03 53.34,21.77 53.47,21.65 52.83,21.65 52.07,20.88 45.97,20.88 44.45,19.36 44.45,17.07 41.53,14.15 41.53,9.71 41.4,9.58 12.57,9.58 12.57,21.27 16,24.69 16,45.78 13.46,48.32
VCC_5V on PWR: 14.73,33.58 13.72,33.58 12.57,32.44 12.57,25.2 12.45,25.2 10.67,23.42 10.67,-0.96 10.54,-1.09 11.68,-2.23 68.58,-2.23 68.58,32.95 67.44,34.09 58.93,34.09 58.8,34.22 58.41,33.83 58.41,20.25 58.55,20.12 56.9,18.47 55.63,18.47 55.63,12.63 54.74,11.74 48.64,11.74 45.59,8.69 45.47,8.69 45.47,3.74 44.7,2.98 19.94,2.98 19.18,3.74 19.18,8.69 19.05,8.82 12.7,8.82 12.32,9.2 12.32,22.15 15.11,24.95 15.11,33.21 15.11,33.21
VINPUT on PWR: 12.83,39.05 13.34,38.54 13.34,33.84 12.06,32.57 12.06,25.33 10.92,24.19 9.78,24.19 9.27,24.69 9.27,27.49 9.14,27.61 9.14,35.72 12.47,39.05
VINPUT on PWR: 20.19,8.82 19.81,8.44 19.81,4.37 20.56,3.63 43.71,3.63 44.58,4.5 44.58,8.95 48.39,12.76 53.59,12.76 53.97,13.14 53.97,14.41 54.99,15.42 54.99,18.72 54.23,19.49 47.88,19.49 46.86,20.5 45.93,20.5 44.96,19.53 44.96,16.44 42.04,13.52 42.04,8.82
ESP_3V3 on PWR: -1.27,60.89 -1.27,-0.45 9.78,-0.45 10.03,-0.2 10.03,23.3 8.89,24.44 8.89,36.12 13.18,40.41 13.18,55.43 14.22,56.47 19.02,56.47 21.98,53.51 21.98,26.97 25.15,23.81 42.12,23.81 42.51,23.42 42.8,23.42 43.69,22.53 44.45,22.53 45.09,23.17 45.09,30.91 46.24,32.06 53.09,32.06 54.36,30.79 54.36,21.14 54.86,20.63 57.53,20.63 58.04,21.14 58.04,34.47 58.42,34.85 66.8,34.85 66.8,60.64 -1.02,60.64

Small or netless copper shapes (teardrops, artwork), in the pictures only: 416 on Top Layer, 88 on Bottom Layer, 40 on PWR

## Text on the board
Bottom Silkscreen Layer: P46 | P3 | P8 | P18 | GND | P6 | P5 | P4 | EN | P9 | P7 | P11 | P10 | P12 | P16 | P15 | P17 | 3V3 | RX | P42 | P41 | P40 | P47 | P21 | P14 | P13 | P1 | TX | P2 | P39 | P38 | P48 | P45 | by Shuaiwen Cui @ NTU
Top Silkscreen Layer: 42|TX | RX|G | 41|2 | 40|1 | 3V3 | GND | + | P46 | P18 | P8 | P3 | VIN | P12 | P11 | P10 | P9 | P21 | P14 | P13 | P39 | P45 | P38 | P48 | P47 | EN｜3V3 | GND｜7 | P6｜15 | P5｜16 | P4｜17 | LiftNode
